# Altium schematic sheet Sheet1.SchDoc
size A; SheetNumber: 1; SheetTotal: 1
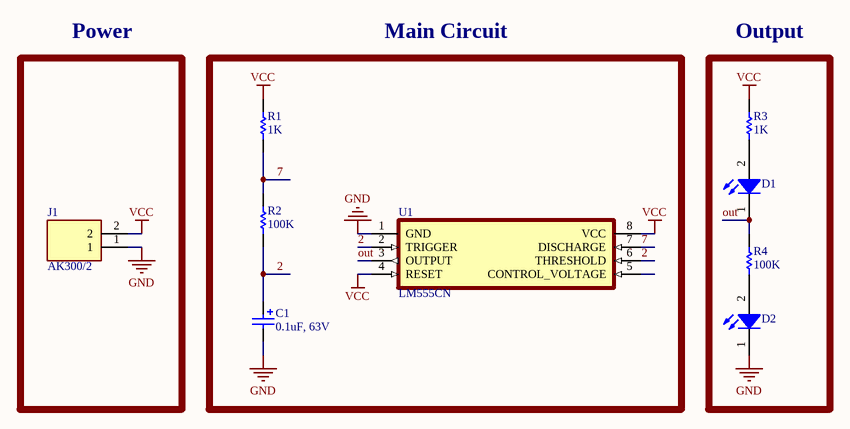
[diagram p0: Sheet1.SchDoc]

## Parts
C1  0.1uF, 63V  [WCAP-ATG8_D5H11]
D1  15400385A3590  [WL-TIRW_D3.9H5.3]  (value not drawn)
D2  15400385A3590  [WL-TIRW_D3.9H5.3]  (value not drawn)
J1  AK300/2  [PTR_AK300/2-5,0-GRAU]
R1  1K  [AXIAL-0.3]
R2  100K  [AXIAL-0.3]
R3  1K  [AXIAL-0.3]
R4  100K  [AXIAL-0.3]
U1  LM555CN  [DIP794W45P254L959H508Q8]

## Blocks framed on the sheet
Power: J1
Main Circuit: C1 R1 R2 U1
Output: D1 D2 R3 R4

## Nets
GND: C1.2(N) D2.1(K) J1.1 U1.1(GND)
VCC: J1.2 R1.2 R3.2 U1.4(RESET) U1.8(VCC)
2: C1.1(P) R2.1 U1.2(TRIGGER) U1.6(THRESHOLD)
7: R1.1 R2.2 U1.7(DISCHARGE)
out: D1.1(K) R4.2 U1.3(OUTPUT)
NetD1_2: D1.2(A) R3.1
NetD2_2: D2.2(A) R4.1

Not connected (* = marked no-connect by the designer): U1 5(CONTROL_VOLTAGE)

## Library data of the parts
C1 = 860010772001: WCAP-ATG8 Aluminum Electrolytic Capacitor, Radial, THT, D5xH11, 0.1uF, 63V; Manufacturer: Wurth Elektronik; Ripple Current: 4mA; Rated Voltage: 63VDC; Technical Reference: ATBC110R10M063DSPA3B000; Leakage Current: 3uA; Endurance: 2000h; Dissipation Factor: 9%; Capacitance Tolerance: +/-20%; ComponentLink2Description: Datasheet; Published Date: October 2020; Packaging: Ammo Pack; Operating Temperature: -40 to +85degC; Mounting Technology: THT; Manufacturer Part Number: 860010772001; Height: 11mm; Diameter: 5mm; ComponentLink2URL: https://www.we-online.com/catalog/datasheet/860010772001.pdf; ComponentLink1URL: http://www.we-online.de; ComponentLink1Description: Manufacturer; Capacitance: 0.1uF
D1 D2 = 15400385A3590: WL-TIRW THT Infrared Round Waterclear, D3.9H5.3, 60mW/sr, 1.5V, 35deg; Manufacturer: Wurth Elektronik; Peak Wavelength: 850nm; Chip Technology: AlGaAs; Centroid Wavelength: 845nm; ComponentLink1Description: Manufacturer; ComponentLink1URL: http://www.we-online.de; ComponentLink2Description: Datasheet; ComponentLink2URL: https://www.we-online.com/catalog/datasheet/15400385A3590.pdf; Operating Temperature: -40 to +85degC; Emitting Color: Infrared; Forward Voltage: 1.5V; Manufacturer Part Number: 15400385A3590; Packaging: Bulk; Mounting Technology: THT; Published Date: August 2020; Radiant Intensity typ.: 60mW/sr; Size: D3.9H5.3; Viewing Angle: 35deg
J1 = AK300/2-5,0-GRAU: Terminal block; 5mm; angled 45Â°; ways: 2; MF: PTR Messtechnik; Value: *; SnapEDA_Link: https://www.snapeda.com/parts/AK300/2-5%2C0-GRAU/PTR%20Messtechnik/view-part/556894/?ref=snap; Package: None; MP: AK300/2-5,0-GRAU; Availability: Unavailable; Price: None
R1-R4 = Res1: Resistor; Published: 8-Jun-2000; LatestRevisionDate: 17-Jul-2002; LatestRevisionNote: Re-released for DXP Platform.; PackageReference: AXIAL-0.3; Publisher: Altium Limited; PackageDescription: Axial Device, Thru-Hole; 2 Leads; 0.3 in Pin Spacing
U1 = LM555CN: MP: LM555CN/NOPB; MF: {'manufacturer': u'ON Semiconductor'}; Package: None; Value: *; Price: None; Availability: Unavailable